# Altium schematic sheet DT01_ID.SchDoc: DT01 Identification
size A4; DocumentNumber: 2; SheetNumber: 2; SheetTotal: 12
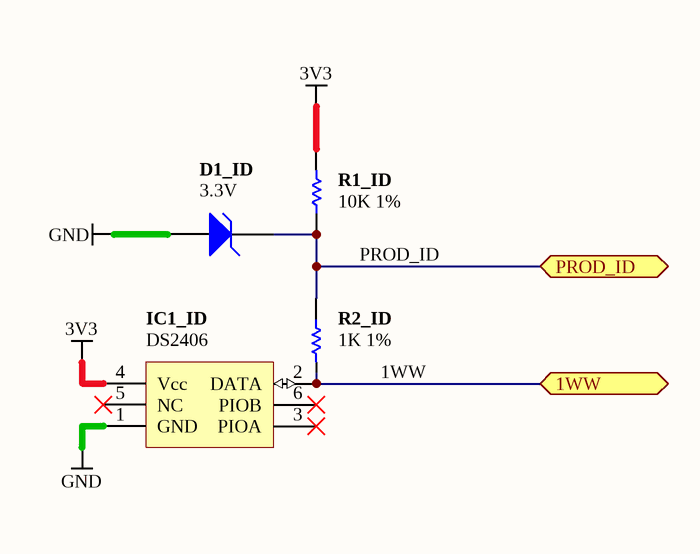
[diagram p0: DT01_ID.SchDoc]

## Parts
D1_ID  3.3V  [SOT95P230-3D]
IC1_ID  DS2406  [TSOC6]
R1_ID  10K 1%  [RESC1005-STAR]
R2_ID  1K 1%  [RESC1005-STAR]

## Ports
1WW (bidir), PROD_ID (bidir)

## Nets
3V3: IC1_ID.4(Vcc) R1_ID.2
GND: D1_ID.1(A) IC1_ID.1(GND)
1WW: IC1_ID.2(DATA) R2_ID.2 ; port 1WW
PROD_ID: D1_ID.2(K) R1_ID.1 R2_ID.1 ; port PROD_ID

Not connected (* = marked no-connect by the designer): IC1_ID 3(PIOA)* 5(NC)* 6(PIOB)*

## Notes on the sheet
- Sheet Title
- Project Title
- Size:
- Date:
- A4
- Assy:
- Time:
- Revision:
- Sheet
- of
- File:

## Library data of the parts
D1_ID = D-150-0005: Zener Diode, 3.3V; Max Forward Current: mA; Mounting Technology: Surface Mount; Rated Voltage: 3.3 V; Status: Production; Category: Diode-Zener
IC1_ID = D-263-0002: Dual Addressable Switch Plus 1KB Memory; Bit Length: Bits; Speed: ps; Supply Voltage: mV; Bit Width: Bits; Mounting Technology: Surface Mount; Status: Unreleased; Technology: None; Category: IC-PROM
R1_ID = D-100-0130: Resistor, 10K 1% 0402 (1005); Power Rating: 63 mW; Category: Resistor; Mounting Technology: Surface Mount; Resistance: 10 K; Status: Production; Tolerance: 1 %
R2_ID = D-100-0121: Resistor, 1K 1% 0402 (1005); Power Rating: 63 mW; Category: Resistor; Mounting Technology: Surface Mount; Resistance: 1 K; Status: Production; Tolerance: 1 %